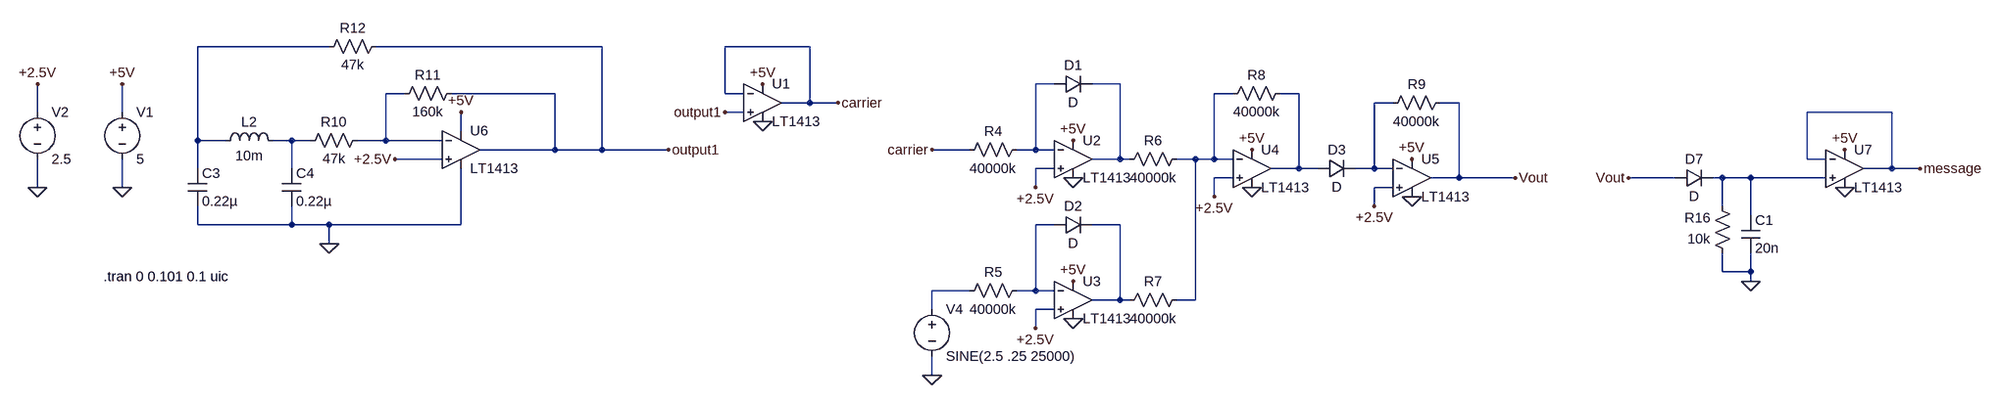
[diagram p0: schematic colpitts.asc]
colpitts.asc, the LTspice schematic file:
Version 4
SHEET 1 3012 2420
WIRE -80 880 -304 880
WIRE 384 880 0 880
WIRE 752 880 608 880
WIRE 1168 944 1136 944
WIRE 1280 944 1232 944
WIRE 48 960 16 960
WIRE 304 960 128 960
WIRE 608 960 608 880
WIRE 640 960 608 960
WIRE 1472 960 1440 960
WIRE 1584 960 1552 960
WIRE 752 976 752 880
WIRE 752 976 704 976
WIRE 800 976 752 976
WIRE 1744 976 1712 976
WIRE 1856 976 1824 976
WIRE -576 992 -576 944
WIRE -432 992 -432 944
WIRE 640 992 608 992
WIRE 2592 992 2448 992
WIRE 144 1024 144 992
WIRE -304 1040 -304 880
WIRE -256 1040 -304 1040
WIRE -144 1040 -176 1040
WIRE -112 1040 -144 1040
WIRE 16 1040 16 960
WIRE 16 1040 -32 1040
WIRE 112 1040 16 1040
WIRE 304 1056 304 960
WIRE 304 1056 176 1056
WIRE 384 1056 384 880
WIRE 384 1056 304 1056
WIRE 512 1056 384 1056
WIRE 1024 1056 960 1056
WIRE 1136 1056 1136 944
WIRE 1136 1056 1104 1056
WIRE 1168 1056 1136 1056
WIRE 112 1072 32 1072
WIRE 1280 1072 1280 944
WIRE 1280 1072 1232 1072
WIRE 1296 1072 1280 1072
WIRE 1408 1072 1376 1072
WIRE 1440 1072 1440 960
WIRE 1440 1072 1408 1072
WIRE 1472 1072 1440 1072
WIRE 2448 1072 2448 992
WIRE 2480 1072 2448 1072
WIRE -304 1088 -304 1040
WIRE -144 1088 -144 1040
WIRE 1168 1088 1136 1088
WIRE 1584 1088 1584 960
WIRE 1584 1088 1536 1088
WIRE 1616 1088 1584 1088
WIRE 1712 1088 1712 976
WIRE 1712 1088 1680 1088
WIRE 1744 1088 1712 1088
WIRE 2592 1088 2592 992
WIRE 2592 1088 2544 1088
WIRE 2640 1088 2592 1088
WIRE 1472 1104 1440 1104
WIRE 1856 1104 1856 976
WIRE 1856 1104 1808 1104
WIRE 1952 1104 1856 1104
WIRE 2224 1104 2144 1104
WIRE 2304 1104 2288 1104
WIRE 2352 1104 2304 1104
WIRE 2480 1104 2352 1104
WIRE -576 1120 -576 1072
WIRE -432 1120 -432 1072
WIRE 1136 1120 1136 1088
WIRE 1744 1120 1712 1120
WIRE 1440 1136 1440 1104
WIRE 1712 1152 1712 1120
WIRE 2304 1152 2304 1104
WIRE 2352 1168 2352 1104
WIRE -304 1184 -304 1152
WIRE -144 1184 -144 1152
WIRE -144 1184 -304 1184
WIRE -80 1184 -144 1184
WIRE 144 1184 144 1088
WIRE 144 1184 -80 1184
WIRE 1168 1184 1136 1184
WIRE 1280 1184 1232 1184
WIRE -80 1216 -80 1184
WIRE 2304 1264 2304 1232
WIRE 2352 1264 2352 1232
WIRE 2352 1264 2304 1264
WIRE 2352 1280 2352 1264
WIRE 1024 1296 960 1296
WIRE 1136 1296 1136 1184
WIRE 1136 1296 1104 1296
WIRE 1168 1296 1136 1296
WIRE 1280 1312 1280 1184
WIRE 1280 1312 1232 1312
WIRE 1296 1312 1280 1312
WIRE 1408 1312 1408 1072
WIRE 1408 1312 1376 1312
WIRE 960 1328 960 1296
WIRE 1168 1328 1136 1328
WIRE 1136 1360 1136 1328
WIRE 960 1440 960 1408
FLAG -432 1120 0
FLAG -576 1120 0
FLAG -576 944 +2.5V
FLAG -432 944 +5V
FLAG 1200 1040 +5V
FLAG 1200 1280 +5V
FLAG 1200 1344 0
FLAG 1200 1104 0
FLAG 1504 1056 +5V
FLAG 1504 1120 0
FLAG 1776 1072 +5V
FLAG 1776 1136 0
FLAG 1952 1104 Vout
FLAG 1136 1120 +2.5V
FLAG 1136 1360 +2.5V
FLAG 1440 1136 +2.5V
FLAG 1712 1152 +2.5V
FLAG 512 1056 output1
FLAG 32 1072 +2.5V
FLAG 144 992 +5V
FLAG -80 1216 0
FLAG 960 1440 0
FLAG 960 1056 carrier
FLAG 2352 1280 0
FLAG 2144 1104 Vout
FLAG 672 944 +5V
FLAG 672 1008 0
FLAG 608 992 output1
FLAG 800 976 carrier
FLAG 2512 1056 +5V
FLAG 2512 1120 0
FLAG 2640 1088 message
SYMBOL voltage -432 976 R0
WINDOW 123 0 0 Left 0
WINDOW 39 0 0 Left 0
SYMATTR InstName V1
SYMATTR Value 5
SYMBOL voltage -576 976 R0
WINDOW 123 0 0 Left 0
WINDOW 39 0 0 Left 0
SYMATTR InstName V2
SYMATTR Value 2.5
SYMBOL Opamps\\LT1413 1200 1008 R0
SYMATTR InstName U2
SYMBOL Opamps\\LT1413 1200 1248 R0
SYMATTR InstName U3
SYMBOL res 1120 1040 R90
WINDOW 0 0 56 VBottom 2
WINDOW 3 32 56 VTop 2
SYMATTR InstName R4
SYMATTR Value 40000k
SYMBOL res 1120 1280 R90
WINDOW 0 0 56 VBottom 2
WINDOW 3 32 56 VTop 2
SYMATTR InstName R5
SYMATTR Value 40000k
SYMBOL diode 1168 960 R270
WINDOW 0 32 32 VTop 2
WINDOW 3 0 32 VBottom 2
SYMATTR InstName D1
SYMBOL diode 1168 1200 R270
WINDOW 0 32 32 VTop 2
WINDOW 3 0 32 VBottom 2
SYMATTR InstName D2
SYMBOL res 1392 1056 R90
WINDOW 0 0 56 VBottom 2
WINDOW 3 32 56 VTop 2
SYMATTR InstName R6
SYMATTR Value 40000k
SYMBOL res 1392 1296 R90
WINDOW 0 0 56 VBottom 2
WINDOW 3 32 56 VTop 2
SYMATTR InstName R7
SYMATTR Value 40000k
SYMBOL Opamps\\LT1413 1504 1024 R0
SYMATTR InstName U4
SYMBOL res 1568 944 R90
WINDOW 0 0 56 VBottom 2
WINDOW 3 32 56 VTop 2
SYMATTR InstName R8
SYMATTR Value 40000k
SYMBOL diode 1616 1104 R270
WINDOW 0 32 32 VTop 2
WINDOW 3 0 32 VBottom 2
SYMATTR InstName D3
SYMBOL Opamps\\LT1413 1776 1040 R0
SYMATTR InstName U5
SYMBOL res 1840 960 R90
WINDOW 0 0 56 VBottom 2
WINDOW 3 32 56 VTop 2
SYMATTR InstName R9
SYMATTR Value 40000k
SYMBOL ind -272 1056 R270
WINDOW 0 32 56 VTop 2
WINDOW 3 5 56 VBottom 2
SYMATTR InstName L2
SYMATTR Value 10m
SYMBOL res -16 1024 R90
WINDOW 0 0 56 VBottom 2
WINDOW 3 32 56 VTop 2
SYMATTR InstName R10
SYMATTR Value 47k
SYMBOL res 144 944 R90
WINDOW 0 0 56 VBottom 2
WINDOW 3 32 56 VTop 2
SYMATTR InstName R11
SYMATTR Value 160k
SYMBOL res 16 864 R90
WINDOW 0 0 56 VBottom 2
WINDOW 3 32 56 VTop 2
SYMATTR InstName R12
SYMATTR Value 47k
SYMBOL cap -320 1088 R0
SYMATTR InstName C3
SYMATTR Value 0.22µ
SYMBOL cap -160 1088 R0
SYMATTR InstName C4
SYMATTR Value 0.22µ
SYMBOL Opamps\\LT1413 144 992 R0
SYMATTR InstName U6
SYMBOL voltage 960 1312 R0
WINDOW 123 0 0 Left 0
WINDOW 39 0 0 Left 0
SYMATTR InstName V4
SYMATTR Value SINE(2.5 .25 25000)
SYMBOL res 2320 1248 R180
WINDOW 0 36 76 Left 2
WINDOW 3 36 40 Left 2
SYMATTR InstName R16
SYMATTR Value 10k
SYMBOL cap 2336 1168 R0
SYMATTR InstName C1
SYMATTR Value 20n
SYMBOL diode 2224 1120 R270
WINDOW 0 32 32 VTop 2
WINDOW 3 0 32 VBottom 2
SYMATTR InstName D7
SYMBOL Opamps\\LT1413 672 912 R0
SYMATTR InstName U1
SYMBOL Opamps\\LT1413 2512 1024 R0
SYMATTR InstName U7
TEXT -464 1272 Left 2 !.tran 0 0.101 0.1 uic

The netlist it stands for:
* colpitts.asc
V1 +5V 0 5
V2 +2.5V 0 2.5
XU2 +2.5V N002 +5V 0 N003 LT1413  ; pins In+ In- V+ V- OUT
XU3 +2.5V N010 +5V 0 N011 LT1413  ; pins In+ In- V+ V- OUT
R4 N002 carrier 40000k
R5 N010 N012 40000k
D1 N002 N003 D
D2 N010 N011 D
R6 N005 N003 40000k
R7 N005 N011 40000k
XU4 +2.5V N005 +5V 0 N006 LT1413  ; pins In+ In- V+ V- OUT
R8 N006 N005 40000k
D3 N006 N007 D
XU5 +2.5V N007 +5V 0 Vout LT1413  ; pins In+ In- V+ V- OUT
R9 Vout N007 40000k
L2 N001 N008 10m
R10 N004 N008 47k
R11 output1 N004 160k
R12 output1 N001 47k
C3 N001 0 0.22µ
C4 N008 0 0.22µ
XU6 +2.5V N004 +5V 0 output1 LT1413  ; pins In+ In- V+ V- OUT
V4 N012 0 SINE(2.5 .25 25000)
R16 0 N009 10k
C1 N009 0 20n
D7 Vout N009 D
XU1 output1 carrier +5V 0 carrier LT1413  ; pins In+ In- V+ V- OUT
XU7 N009 message +5V 0 message LT1413  ; pins In+ In- V+ V- OUT
.model D D
.lib standard.dio
.tran 0 0.101 0.1 uic
.lib LTC.lib
.backanno
.end